# EAGLE schematic PeripheralExample (EAGLE 6.2)
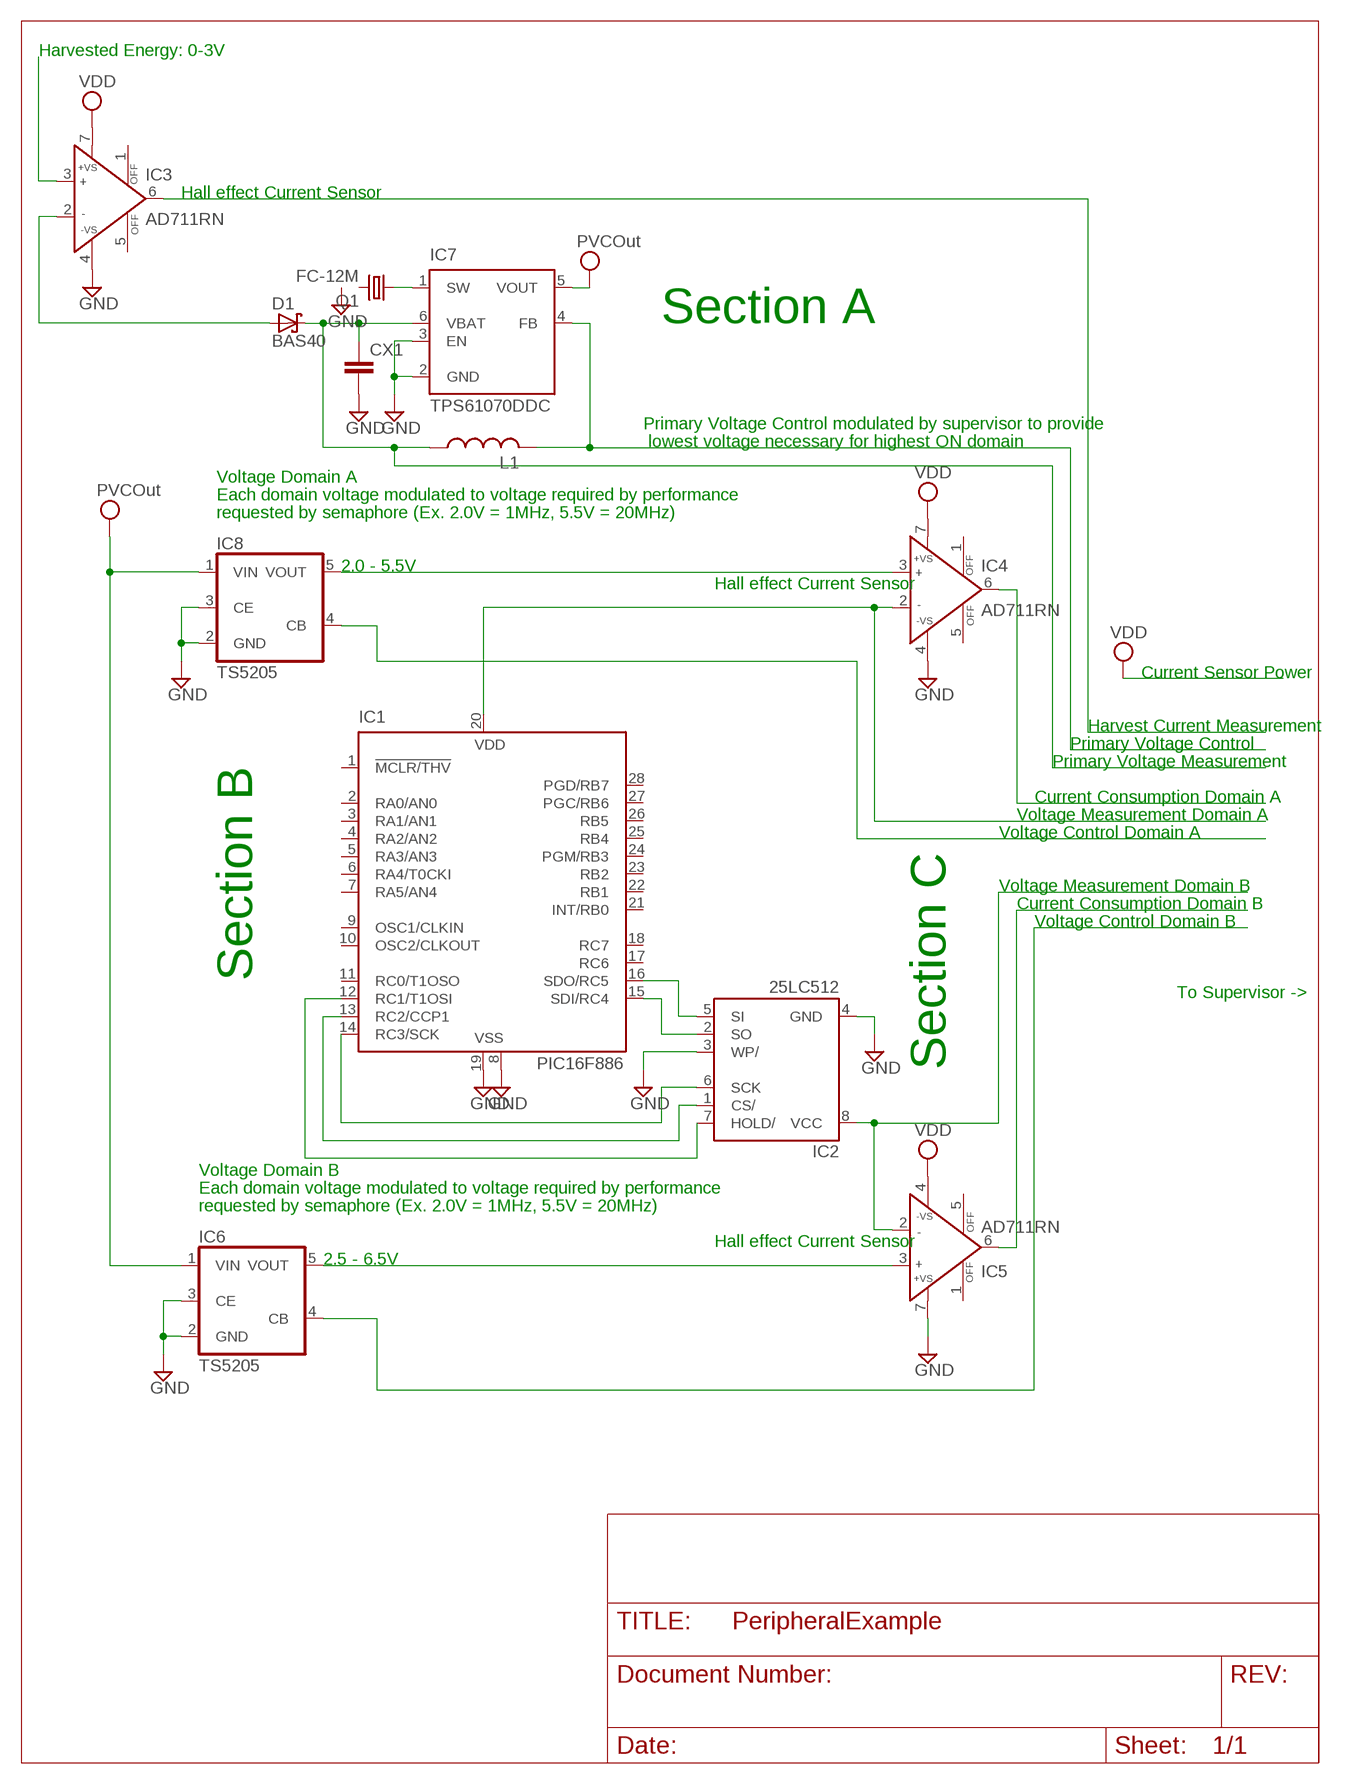
[diagram p0: schematic, sheet 1]

## Parts
CX1  CXXC10B5  [XC10B5]
D1  BAS40  [SOT23]
IC1  PIC16F886  PIC16F876SO  [SO28W]
IC2  25LC512  AT25P  [DIL08]
IC3  AD711RN  [SO8]
IC4  AD711RN  [SO8]
IC5  AD711RN  [SO8]
IC6  TS5205  [SOT25]
IC7  TPS61070DDC  [TSOT23-6_DDC]
IC8  TS5205  [SOT25]
L1  L-USLAP02KR  [LAP02KR]
Q1  FC-12M  [FC-12M]

## Nets
GND: CX1.2 IC1.8(VSS) IC1.19(VSS) IC2.3(WP/) IC2.4(GND) IC3.4(-VS) IC4.4(-VS) IC5.7(+VS) IC6.2(GND) IC6.3(CE) IC7.2(GND) IC7.3(EN) IC8.2(GND) IC8.3(CE)
N$1: IC3.3(IN+)
N$2: IC4.3(IN+) IC8.5(VOUT)
N$3: IC1.20(VDD) IC4.2(IN-)
N$4: CX1.1 D1.3(C) IC7.6(VBAT) L1.1
N$5: IC2.8(VCC) IC5.2(IN-)
N$6: IC1.15(SDI/RC4) IC2.2(SO)
N$7: IC1.16(SDO/RC5) IC2.5(SI)
N$8: IC1.14(RC3/SCK) IC2.6(SCK)
N$9: IC1.13(RC2/CCP1) IC2.1(CS/)
N$10: IC1.12(RC1/T1OSI) IC2.7(HOLD/)
N$11: IC3.6(OUT)
N$12: IC7.4(FB) L1.2
N$13: IC8.4(CB)
N$14: IC7.1(SW) Q1.1
N$15: IC4.6(OUT)
N$16: IC6.4(CB)
N$17: IC5.6(OUT)
N$18: IC5.3(IN+) IC6.5(VOUT)
N$19: D1.1(A) IC3.2(IN-)
VDD: IC3.7(+VS) IC4.7(+VS) IC5.4(-VS) IC6.1(VIN) IC7.5(VOUT) IC8.1(VIN) ; supply symbol labelled PVCOut
Unconnected: IC1.1(!MCLR/THV) IC1.2(RA0/AN0) IC1.3(RA1/AN1) IC1.4(RA2/AN2) IC1.5(RA3/AN3) IC1.6(RA4/T0CKI) IC1.7(RA5/AN4) IC1.9(OSC1/CLKIN) IC1.10(OSC2/CLKOUT) IC1.11(RC0/T1OSO) IC1.17(RC6) IC1.18(RC7) IC1.21(INT/RB0) IC1.22(RB1) IC1.23(RB2) IC1.24(PGM/RB3) IC1.25(RB4) IC1.26(RB5) IC1.27(PGC/RB6) IC1.28(PGD/RB7) IC3.1(OFF) IC3.5(OFF) IC4.1(OFF) IC4.5(OFF) IC5.1(OFF) IC5.5(OFF) Q1.2

## Notes on the sheet
- Harvested Energy: 0-3V
- Hall effect Current Sensor
- Section A
- Primary Voltage Control modulated by supervisor to provide
- lowest voltage necessary for highest ON domain
- Voltage Domain A
- Each domain voltage modulated to voltage required by performance
- requested by semaphore (Ex. 2.0V = 1MHz, 5.5V = 20MHz)
- 2.0 - 5.5V
- Hall effect Current Sensor
- Current Sensor Power
- Harvest Current Measurement
- Primary Voltage Control
- Primary Voltage Measurement
- Current Consumption Domain A
- Voltage Measurement Domain A
- Voltage Control Domain A
- Voltage Measurement Domain B
- Current Consumption Domain B
- Voltage Control Domain B
- Section B
- To Supervisor ->
- Section C
- Voltage Domain B
- Each domain voltage modulated to voltage required by performance
- requested by semaphore (Ex. 2.0V = 1MHz, 5.5V = 20MHz)
- Hall effect Current Sensor
- 2.5 - 6.5V

## Library data of the parts
CX1 = rcl:CX: X CAPACITOR for power line
D1 = diode:BAS40: Silicon Schottky Diodes General-purpose diode for high-speed switching
IC1 = microchip:PIC16*876: MICROCONTROLLER flash type; MF: MICROCHIP; MPN: PIC16F876-20/SO; OC_FARNELL: 9761268; OC_NEWARK: 12C1950
IC2 = atmel:AT25*: SPI bus serial EEPROM; MPN: CAT25040LI-G; OC_FARNELL: 1718045; OC_NEWARK: 06R0588
IC3-IC5 = analog-devices:AD711: Precision, Low Cost, High Speed, BiFET Op Amp Source: http://www.analog.com/static/imported-files/data_sheets/AD711.pdf; MF: ALTERA CORPORATION; MPN: AD711KRZ; OC_FARNELL: 9426396; OC_NEWARK: 59K4541
IC6 IC8 = v-reg:TS5205: 150mA Low Noise LDO Voltage Regulator with Enable TSC [Taiwan Semiconductor Company, Ltd] Source: http://www.taiwansemi.com .. 5205_0409c.pdf
IC7 = texas:TPS6107*: 90% EFFICIENT SYNCHRONOUS BOOST CONVERTER WITH 600-mA SWITCH Source: http://focus.ti.com/lit/ds/symlink/tps61070.pdf; MPN: TPS61070DDCR; OC_FARNELL: 1461062; OC_NEWARK: 64M3125
L1 = rcl:L-US: INDUCTOR, American symbol
Q1 = crystal:FC-12M: kHz RANGE CRYSTAL UNIT LOW PROFILE SMD Source: Epson Toyocom FC-12M.pdf